# Altium project pca20020.PrjPCB (part 3 of 3)
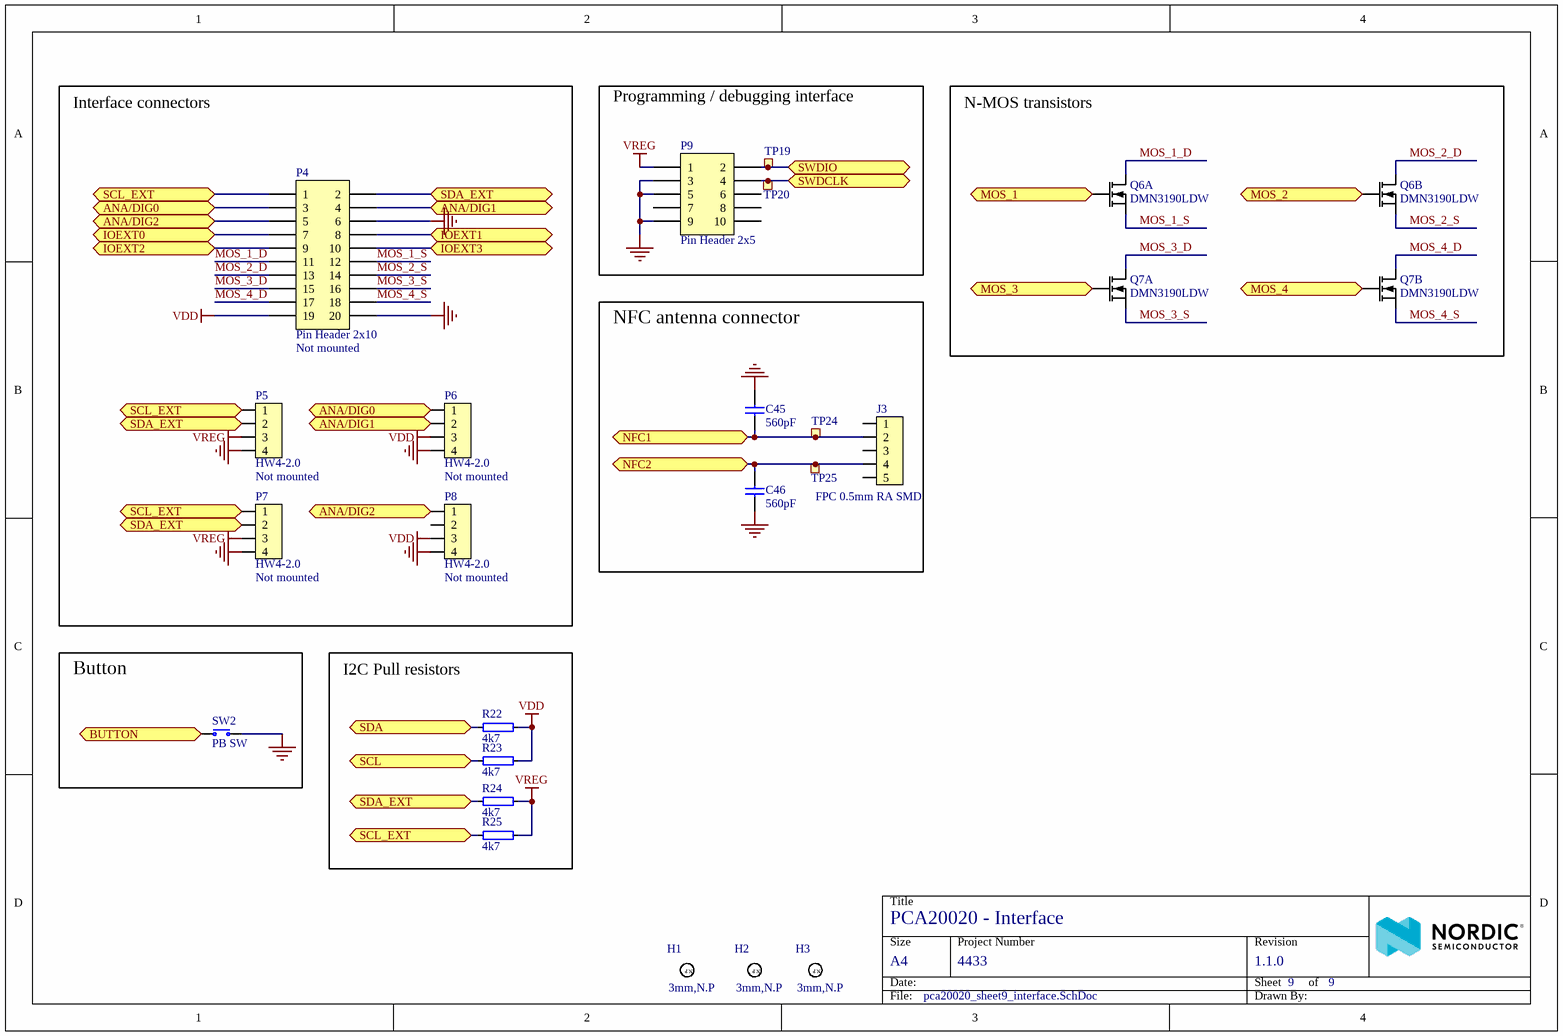
[diagram p9: pca20020_sheet9_interface.SchDoc]

## Nets that join several sheets
GND: pca20020_sheet2_mcu (20 pins), pca20020_sheet3_io_expander (8 pins), pca20020_sheet5_motion_sensors (16 pins), pca20020_sheet6_environment_sensors (18 pins), pca20020_sheet7_sound_and_light (18 pins), pca20020_sheet8_power_supply (29 pins), pca20020_sheet9_interface (12 pins)
VDD: pca20020_sheet3_io_expander (7 pins), pca20020_sheet5_motion_sensors (C18.2 U4.14 U4.15), pca20020_sheet6_environment_sensors (13 pins), pca20020_sheet7_sound_and_light (10 pins), pca20020_sheet8_power_supply (TP11.1 U15.1), pca20020_sheet9_interface (5 pins)
VDD_nRF: pca20020_sheet2_mcu (6 pins), pca20020_sheet8_power_supply (P2.2 SB2.1)
VLi-Ion: pca20020_sheet7_sound_and_light (U13.5), pca20020_sheet8_power_supply (10 pins)
VREG: pca20020_sheet5_motion_sensors (7 pins), pca20020_sheet8_power_supply (8 pins), pca20020_sheet9_interface (5 pins)
BAT_MON_EN: pca20020_sheet3_io_expander (U2.5), pca20020_sheet8_power_supply (Q1.2 R2.1)
CCS_PWR_CTRL: pca20020_sheet3_io_expander (U2.15), pca20020_sheet6_environment_sensors (U10.2)
CCS_RESET: pca20020_sheet3_io_expander (U2.16), pca20020_sheet6_environment_sensors (U9.2)
CCS_WAKE: pca20020_sheet3_io_expander (U2.19), pca20020_sheet6_environment_sensors (U9.7)
IOEXT0: pca20020_sheet3_io_expander (U2.27), pca20020_sheet9_interface (P4.7)
IOEXT1: pca20020_sheet3_io_expander (U2.28), pca20020_sheet9_interface (P4.8)
IOEXT2: pca20020_sheet3_io_expander (U2.1), pca20020_sheet9_interface (P4.9)
IOEXT3: pca20020_sheet3_io_expander (U2.2), pca20020_sheet9_interface (P4.10)
LIGHTWELL_B: pca20020_sheet3_io_expander (U2.7), pca20020_sheet7_sound_and_light (Q2.5 R31.2)
LIGHTWELL_G: pca20020_sheet3_io_expander (U2.6), pca20020_sheet7_sound_and_light (Q3.2 R30.2)
LIGHTWELL_R: pca20020_sheet3_io_expander (U2.8), pca20020_sheet7_sound_and_light (Q2.2 R29.2)
LIS_INT1: pca20020_sheet4_pin_map (SB9.1), pca20020_sheet5_motion_sensors (U5.12)
LIS_INT2: pca20020_sheet4_pin_map (SB10.1), pca20020_sheet5_motion_sensors (U5.11)
MIC_PWR_CTRL: pca20020_sheet3_io_expander (U2.14), pca20020_sheet7_sound_and_light (U12.2)
MPU_PWR_CTRL: pca20020_sheet3_io_expander (U2.13), pca20020_sheet5_motion_sensors (U4.2)
P0.02: pca20020_sheet2_mcu (U1.4), pca20020_sheet9_interface (P4.3 P6.1)
P0.03: pca20020_sheet2_mcu (U1.5), pca20020_sheet9_interface (P4.4 P6.2)
P0.04: pca20020_sheet2_mcu (U1.6), pca20020_sheet9_interface (P4.5 P8.1)
P0.05: pca20020_sheet2_mcu (U1.7), pca20020_sheet3_io_expander (U2.11)
P0.06: pca20020_sheet2_mcu (U1.8), pca20020_sheet5_motion_sensors (U4.4)
P0.07: pca20020_sheet2_mcu (U1.9), pca20020_sheet3_io_expander (U2.24), pca20020_sheet4_pin_map (TP17.1), pca20020_sheet5_motion_sensors (U4.7), pca20020_sheet6_environment_sensors (U6.4 U7.4 U8.6 U10.11), pca20020_sheet9_interface (R22.2)
P0.08: pca20020_sheet2_mcu (U1.10), pca20020_sheet3_io_expander (U2.25), pca20020_sheet4_pin_map (TP18.1), pca20020_sheet5_motion_sensors (U4.11), pca20020_sheet6_environment_sensors (U6.2 U7.2 U8.5 U10.7), pca20020_sheet9_interface (R23.2)
P0.09: pca20020_sheet2_mcu (U1.11), pca20020_sheet9_interface (C45.1 J3.2 TP24.1)
P0.10: pca20020_sheet2_mcu (U1.12), pca20020_sheet9_interface (C46.2 J3.4 TP25.1)
P0.11: pca20020_sheet2_mcu (U1.14), pca20020_sheet9_interface (SW2.2)
P0.12: pca20020_sheet2_mcu (U1.15), pca20020_sheet4_pin_map (SB9.2 SB10.2)
P0.13: pca20020_sheet2_mcu (U1.16), pca20020_sheet8_power_supply (R13.2 R14.1)
P0.14: pca20020_sheet2_mcu (U1.17), pca20020_sheet5_motion_sensors (U5.4), pca20020_sheet9_interface (P4.2 P5.2 P7.2 R24.2)
P0.15: pca20020_sheet2_mcu (U1.18), pca20020_sheet5_motion_sensors (U5.1), pca20020_sheet9_interface (P4.1 P5.1 P7.1 R25.2)
P0.16: pca20020_sheet2_mcu (U1.19), pca20020_sheet3_io_expander (R1.1 U2.23)
P0.17: pca20020_sheet2_mcu (U1.20), pca20020_sheet8_power_supply (R15.2 R16.1 U16.3)
P0.18: pca20020_sheet2_mcu (U1.21), pca20020_sheet9_interface (Q6.2)
P0.19: pca20020_sheet2_mcu (U1.22), pca20020_sheet9_interface (Q6.5)
P0.20: pca20020_sheet2_mcu (U1.23), pca20020_sheet9_interface (Q7.2)
P0.21: pca20020_sheet2_mcu (U1.24), pca20020_sheet9_interface (Q7.5)
P0.22: pca20020_sheet2_mcu (U1.27), pca20020_sheet6_environment_sensors (U10.4)
P0.23: pca20020_sheet2_mcu (U1.28), pca20020_sheet6_environment_sensors (U6.7)
P0.24: pca20020_sheet2_mcu (U1.29), pca20020_sheet6_environment_sensors (U7.3)
P0.25: pca20020_sheet2_mcu (C33.2 U1.37), pca20020_sheet7_sound_and_light (U12.12)
P0.26: pca20020_sheet2_mcu (C32.2 U1.38), pca20020_sheet7_sound_and_light (U12.8)
P0.27: pca20020_sheet2_mcu (U1.39), pca20020_sheet7_sound_and_light (D1.1 Q4.2 SB7.2 TP21.1)
P0.28: pca20020_sheet2_mcu (U1.40), pca20020_sheet8_power_supply (R20.2 R21.1)
P0.29: pca20020_sheet2_mcu (U1.41), pca20020_sheet7_sound_and_light (U13.3)
P0.30: pca20020_sheet2_mcu (U1.42), pca20020_sheet8_power_supply (U15.3)
P0.31: pca20020_sheet2_mcu (U1.43), pca20020_sheet6_environment_sensors (U8.7)
SENSE_LED_B: pca20020_sheet3_io_expander (U2.22), pca20020_sheet7_sound_and_light (R12.1)
SENSE_LED_G: pca20020_sheet3_io_expander (U2.21), pca20020_sheet7_sound_and_light (R11.1)
SENSE_LED_R: pca20020_sheet3_io_expander (U2.20), pca20020_sheet7_sound_and_light (R10.1)
SWDCLK: pca20020_sheet2_mcu (U1.25), pca20020_sheet9_interface (P9.4 TP20.1)
SWDIO: pca20020_sheet2_mcu (U1.26), pca20020_sheet9_interface (P9.2 TP19.1)